# Altium schematic sheet Display.SchDoc
size A4; SheetNumber: 6; SheetTotal: 9
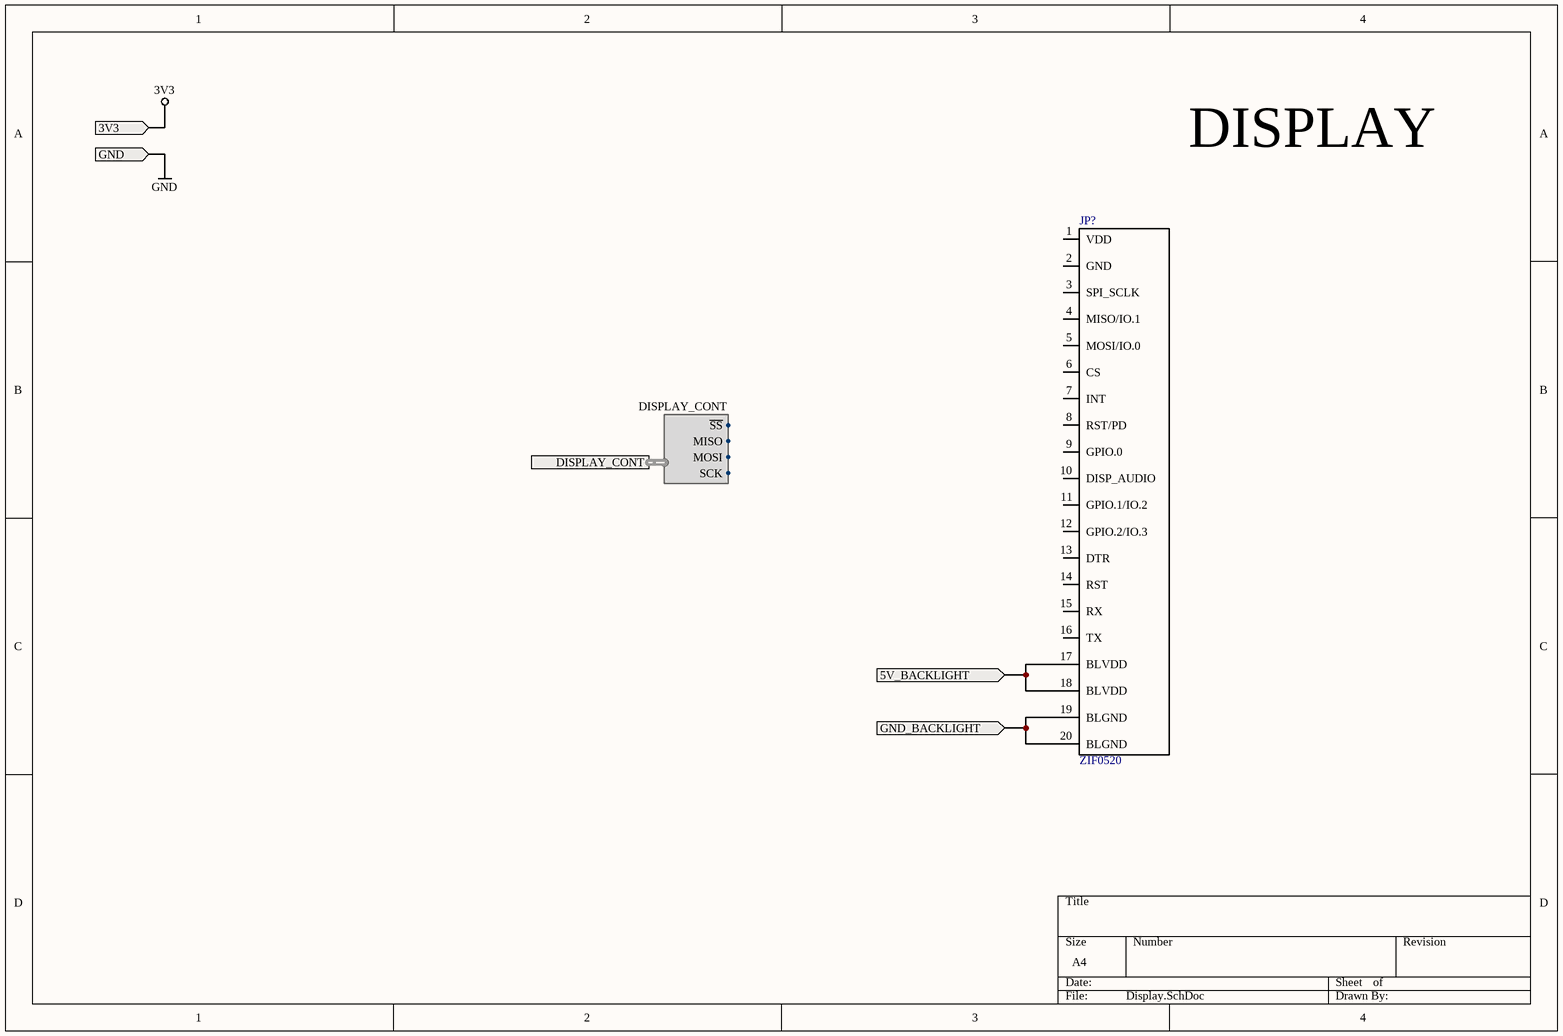
[diagram p0: Display.SchDoc]

## Parts
JP?  ZIF0520

## Ports
3V3 (in), 5V_BACKLIGHT (in), DISPLAY_CONT (harness DISPLAY_CONT), GND (in), GND_BACKLIGHT (in)

## Harnesses
DISPLAY_CONT: MOSI, MISO, SCK, ~{SS}

## Nets
3V3: port 3V3
GND: port GND
5V_BACKLIGHT: JP?.17(BLVDD) JP?.18(BLVDD) ; port 5V_BACKLIGHT
GND_BACKLIGHT: JP?.19(BLGND) JP?.20(BLGND) ; port GND_BACKLIGHT

Not connected (* = marked no-connect by the designer): JP? 1(VDD) 2(GND) 3(SPI_SCLK) 4(MISO/IO.1) 5(MOSI/IO.0) 6(CS) 7(INT) 8(RST/PD) 9(GPIO.0) 10(DISP_AUDIO) 11(GPIO.1/IO.2) 12(GPIO.2/IO.3) 13(DTR) 14(RST) 15(RX) 16(TX)

## Notes on the sheet
- DISPLAY

## Library data of the parts
JP? = ZIF0520: Display Connector RiBus